# Altium schematic sheet Power Input and Buck Convertors.SchDoc
size A4; SheetNumber: 10; SheetTotal: 10
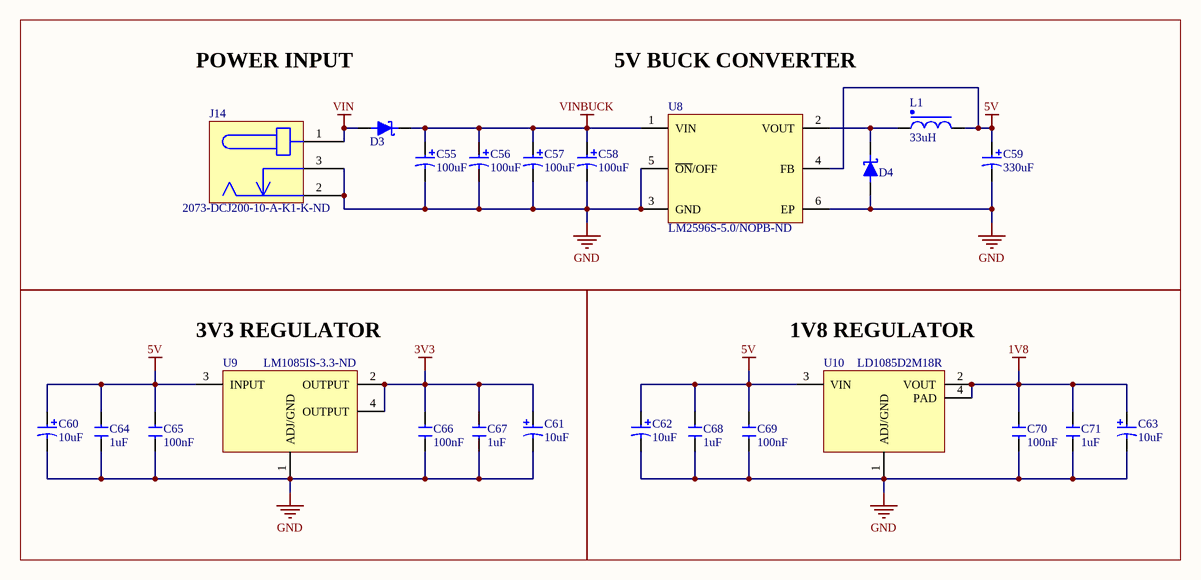
[diagram p0: Power Input and Buck Convertors.SchDoc]

## Parts
C55  Capacitance: 100uF  [RADIAL-2_6.3MMX7.7MM]  (hidden comment: CAP_100uF_%20_25V_ALUM_SMD)
C56  Capacitance: 100uF  [RADIAL-2_6.3MMX7.7MM]  (hidden comment: CAP_100uF_%20_25V_ALUM_SMD)
C57  Capacitance: 100uF  [RADIAL-2_6.3MMX7.7MM]  (hidden comment: CAP_100uF_%20_25V_ALUM_SMD)
C58  Capacitance: 100uF  [RADIAL-2_6.3MMX7.7MM]  (hidden comment: CAP_100uF_%20_25V_ALUM_SMD)
C59  Capacitance: 330uF  [RADIAL-2_8MMX10MM]  (hidden comment: CAP_330uF_%20_25V_ALUM_SMD)
C60  Capacitance: 10uF  [1206_TANT_CAP]  (hidden comment: CAP_10uF_10%_1206_10V_TANT)
C61  Capacitance: 10uF  [1206_TANT_CAP]  (hidden comment: CAP_10uF_10%_1206_10V_TANT)
C62  Capacitance: 10uF  [1206_TANT_CAP]  (hidden comment: CAP_10uF_10%_1206_10V_TANT)
C63  Capacitance: 10uF  [1206_TANT_CAP]  (hidden comment: CAP_10uF_10%_1206_10V_TANT)
C64  1uF  [0805_CAP]
C65  Capacitance: 100nF  [0805_CAP]  (hidden comment: CAP_0.1uF_%20_50V_0805_X7R_CER)
C66  Capacitance: 100nF  [0805_CAP]  (hidden comment: CAP_0.1uF_%20_50V_0805_X7R_CER)
C67  1uF  [0805_CAP]
C68  1uF  [0805_CAP]
C69  Capacitance: 100nF  [0805_CAP]  (hidden comment: CAP_0.1uF_%20_50V_0805_X7R_CER)
C70  Capacitance: 100nF  [0805_CAP]  (hidden comment: CAP_0.1uF_%20_50V_0805_X7R_CER)
C71  1uF  [0805_CAP]
D3  D1FH3/5053  [DIOM5226X220N_D1FH3/5053]  (value not drawn)
D4  DIODE_SCHOTTKY_60V_3A_DO-214AC/SMA  [DIOM5226X220N-SMA]  (value not drawn)
J14  Supplier Part Number 1: 2073-DCJ200-10-A-K1-K-ND  [DC_POWER_JACK_2MM]  (hidden comment: CON_JACK_POWER_PCB TYPE_2MM_KLS)
L1  Inductance: 33uH  [INDP120120X800N]  (hidden comment: IND_33uH_5A_65mOHM_12X12MM_SMD)
U8  Supplier Part Number 1: LM2596S-5.0/NOPB-ND  [TO170P1524X483-6N]  (hidden comment: PMIC_LM2596S-5.0/NOPB)
U9  Supplier Part Number 1: LM1085IS-3.3-ND  [TO254P1524X483-4N]  (hidden comment: PMIC_LIN REG_LM1085IS-3.3)
U10  LD1085D2M18R  [DPAK254P1542X460-4N]

## Blocks framed on the sheet
3V3 REGULATOR: C60 C61 C64-C67 U9
1V8 REGULATOR: C62 C63 C68-C71 U10

## Nets
1V8: C63.1 C70.2 C71.2 U10.2(VOUT) U10.4(PAD)
3V3: C61.1 C66.2 C67.2 U9.2(OUTPUT) U9.4(OUTPUT)
5V: C59.1 C60.1 C62.1 C64.2 C65.2 C68.2 C69.2 L1.2 U8.4(FB) U9.3(INPUT) U10.3(VIN)
GND: C55.2 C56.2 C57.2 C58.2 C59.2 C60.2 C61.2 C62.2 C63.2 C64.1 C65.1 C66.1 C67.1 C68.1 C69.1 C70.1 C71.1 D4.2(ANODE) J14.2(GND) J14.3(GND) U8.3(GND) U8.5(~{ON}/OFF) U8.6(EP) U9.1(ADJ/GND) U10.1(ADJ/GND)
VIN: D3.2(ANODE) J14.1(VIN)
VINBUCK: C55.1 C56.1 C57.1 C58.1 D3.1(CATHODE) U8.1(VIN)
NetD4_1: D4.1(CATHODE) L1.1 U8.2(VOUT)

## Notes on the sheet
- POWER INPUT
- 5V BUCK CONVERTER

## Library data of the parts
C55-C58 = CAP_100uF_%20_25V_ALUM_SMD: CAP.EL.100uF 25V 6.3x7.7 105C 5000HRS SMD; Manufacturer: SAMYOUNG; Manufacturer Part Number: BLA25VC100MF80TP; Ripple Current: 230mA; Tolerance: 20%; Category: Aluminum Electrolytic Capacitors; Voltage Rating: 25V
C59 = CAP_330uF_%20_25V_ALUM_SMD: CAP.EL.330uF 25V 8x10 105C 5000Hrs SMD AECQ-200; Manufacturer: SAMYOUNG; Manufacturer Part Number: BXJ25VC330MH10TP; Ripple Current: 600mA; Tolerance: 20%; Category: Aluminum Electrolytic Capacitors; Voltage Rating: 25V
C60-C63 = CAP_10uF_10%_1206_10V_TANT: Cap Tant Solid 10uF 10V A CASE 10% (3.2 X 1.6 X 1.6mm) Inward L SMD 3216-18 3 Ohm 125C T/R; Manufacturer: Kyocera AVX; Manufacturer Part Number: TAJA106K010SNJ; ESR (Equivalent Series Resistance): 3R; Leakage Current: 1uA; Polarity: Polar; Dissipation Factor: 6%; Supplier 1: Digi-Key; RoHS: Yes; Category: Tantalum Capacitors; Stock 1: 14579; Pricing 1: 1=0,31000, 10=0,21300, 50=0,14920, 100=0,12780, 500=0,09584, 1000=0,08094, 2500=0,07668 (USD); Case/Package: Molded; Number of Pins: 2; Case Code (Imperial): 1206; Case Code (Metric): 3216; Min Operating Temperature: -55°C; Max Operating Temperature: 125°C; Tolerance: 10%; Packaging: Tape and Reel; Voltage Rating: 10V; Package Quantity: 8000; Termination: SMD/SMT; Voltage Rating (DC): 10V; Series: TAJ; Construction: Flat; Length: 3.2mm; Width: 1.6mm; Height: 1.8mm; Depth: 1.6mm; Radiation Hardening: No; Lead Free: Lead Free; RoHS Compliant: Yes; ComponentLink1URL: https://datasheet.ciiva.com/12909/taj-27497-12909898.pdf?src-supplier=Mouser; ComponentLink1Description: https://datasheet.ciiva.com/12909/taj-27497-12909898.pdf?src-supplier=Mouser; Supplier Part Number 1: 478-13122-1-ND
C64 C67 C68 C71 = CAP_1uF_%10_25V_0805_X7R_CER: 陶瓷电容 1uF(105) 1uF ±10% 25V 0805; Manufacturer: Samsung; Manufacturer Part Number: CL21B105KAFNNNG; Material: Ceramic; Dielectric: X7R; Supplier 1: Digi-Key; RoHS: Yes; Category: Ceramic Capacitors; Stock 1: 509034; Pricing 1: 1=0,10000, 10=0,07100, 50=0,03880, 100=0,03170, 500=0,02264, 1000=0,01779 (USD); Mount: Surface Mount; Case/Package: 0805; Case Code (Metric): 2012; Case Code (Imperial): 0805; Min Operating Temperature: -55°C; Max Operating Temperature: 125°C; Tolerance: 10%; Capacitance: 1uF; Voltage Rating: 25V; Package Quantity: 3000; Packaging: Tape and Reel; Voltage: 25V; Series: CL; Length: 2mm; Width: 0.049inch; Height: 1.25mm; Thickness: 0.053inch; Depth: 1.25mm; Radiation Hardening: No; RoHS Compliant: Yes; ComponentLink1URL: https://datasheet.ciiva.com/26920/getdatasheetpartid-698495-26920200.pdf?src-supplier=Verical; ComponentLink1Description: https://datasheet.ciiva.com/26920/getdatasheetpartid-698495-26920200.pdf?src-supplier=Verical; ComponentLink2URL: https://datasheet.ciiva.com/29199/455911-da-01-en-vs-kondensator-0805-29199043.pdf?src-supplier=Conrad; ComponentLink2Description: https://datasheet.ciiva.com/29199/455911-da-01-en-vs-kondensator-0805-29199043.pdf?src-supplier=Conrad; ComponentLink3URL: https://datasheet.ciiva.com/16428/cl05b104kq5nnnc-16428871.pdf?src-supplier=Future+Electronics; ComponentLink3Description: https://datasheet.ciiva.com/16428/cl05b104kq5nnnc-16428871.pdf?src-supplier=Future+Electronics; Supplier Part Number 1: 1276-6469-1-ND
C65 C66 C69 C70 = CAP_0.1uF_%20_50V_0805_X7R_CER: Cap Ceramic 0.1uF 50V X7R 20% SMD 0805 125C Paper T/R; Manufacturer: KEMET; Manufacturer Part Number: C0805C104M5RACTU; Supplier 1: Digi-Key; RoHS: Yes; Category: Ceramic Capacitors; Stock 1: 4863; Pricing 1: 1=0,10000, 10=0,06400, 50=0,03500, 100=0,02860, 500=0,02040, 1000=0,01603 (USD); Mount: Surface Mount; Case/Package: 0805; Dielectric Material: Ceramic; Min Operating Temperature: -55°C; Max Operating Temperature: 125°C; Tolerance: 20%; Dielectric: X7R; Packaging: Tape and Reel; Voltage Rating (DC): 50V; Length: 2mm; Height: 0.9mm; Depth: 1.25mm; Radiation Hardening: No; ComponentLink1URL: http://uk.rs-online.com/webdocs/13da/0900766b813daa06.pdf?src-supplier=RSComponents; ComponentLink1Description: http://uk.rs-online.com/webdocs/13da/0900766b813daa06.pdf?src-supplier=RSComponents; ComponentLink2URL: https://www.verical.com/server-webapp/html/getDatasheet?partID=774625&src-supplier=Verical; ComponentLink2Description: https://www.verical.com/server-webapp/html/getDatasheet?partID=774625&src-supplier=Verical; ComponentLink3URL: http://www.farnell.com/datasheets/2739857.pdf?src-supplier=Farnell; ComponentLink3Description: http://www.farnell.com/datasheets/2739857.pdf?src-supplier=Farnell; ComponentLink4URL: http://uk.rs-online.com/webdocs/1515/0900766b81515223.pdf?src-supplier=RSComponents; ComponentLink4Description: http://uk.rs-online.com/webdocs/1515/0900766b81515223.pdf?src-supplier=RSComponents; ComponentLink5URL: http://components.arrow.com/part/dataview/0323_00324812?src-supplier=Arrow+Europe; ComponentLink5Description: http://components.arrow.com/part/dataview/0323_00324812?src-supplier=Arrow+Europe; ComponentLink6URL: http://uk.rs-online.com/webdocs/1528/0900766b81528e2f.pdf?src-supplier=RSComponents; ComponentLink6Description: http://uk.rs-online.com/webdocs/1528/0900766b81528e2f.pdf?src-supplier=RSComponents; ComponentLink7URL: http://www.farnell.com/datasheets/2739857.pdf?src-supplier=Newark; ComponentLink7Description: http://www.farnell.com/datasheets/2739857.pdf?src-supplier=Newark; ComponentLink8URL: http://www.alliedelec.com/m/d/9bfe7773041ffe9d406e68bc7b377fdd.pdf?src-supplier=Allied+Electronics; ComponentLink8Description: http://www.alliedelec.com/m/d/9bfe7773041ffe9d406e68bc7b377fdd.pdf?src-supplier=Allied+Electronics; ComponentLink9URL: https://api.kemet.com/component-edge/download/datasheet/C0805C104M5RACTU.pdf?src-supplier=Digi-Key; ComponentLink9Description: https://api.kemet.com/component-edge/download/datasheet/C0805C104M5RACTU.pdf?src-supplier=Digi-Key; ComponentLink10URL: http://capacitoredge.kemet.com/capedge2/DataSheet?pn=C0805C104M5RACTU&src-supplier=Avnet+Europe; ComponentLink10Description: http://capacitoredge.kemet.com/capedge2/DataSheet?pn=C0805C104M5RACTU&src-supplier=Avnet+Europe; ComponentLink11URL: http://www.farnell.com/datasheets/2739857.pdf?src-supplier=Element14; ComponentLink11Description: http://www.farnell.com/datasheets/2739857.pdf?src-supplier=Element14; ComponentLink12URL: http://www.mouser.com/ds/2/212/KEM_C1002_X7R_SMD-1102033.pdf?src-supplier=Mouser; ComponentLink12Description: http://www.mouser.com/ds/2/212/KEM_C1002_X7R_SMD-1102033.pdf?src-supplier=Mouser; ComponentLink13URL: https://www.verical.com/server-webapp/html/getDatasheet?partID=91523&src-supplier=Verical; ComponentLink13Description: https://www.verical.com/server-webapp/html/getDatasheet?partID=91523&src-supplier=Verical; ComponentLink14URL: http://components.arrow.com/part/dataview/2091108S8109171N7429?src-supplier=Arrow+Electronics; ComponentLink14Description: http://components.arrow.com/part/dataview/2091108S8109171N7429?src-supplier=Arrow+Electronics; Supplier Part Number 1: 399-C0805C104M5RAC7800CT-ND
D3 = DIODE_SCHOTTKY_30V_3A_DO214AC/SMA_SMT: Schottky-diode 3A 30V 1F; Manufacturer: Shindengen; Supplier 1: Mouser; RoHS: Yes; Category: Uncategorized; ComponentLink1URL: https://datasheet.ciiva.com/13080/j532-d1fh3-30122-13080653.pdf?src-supplier=Mouser; ComponentLink1Description: https://datasheet.ciiva.com/13080/j532-d1fh3-30122-13080653.pdf?src-supplier=Mouser; Packaging: Tape and Reel; Manufacturer Part Number: D1FH3/5053; Supplier Part Number 1: 627-D1FH35053; Case/Package: SMA
D4 = DIODE_SCHOTTKY_60V_3A_DO-214AC/SMA: DIODE SCHOTTKY 3A 60V DO-214AC SMA; Manufacturer Part Number: SS36-JQ; Average Rectified Current: 3A; Max Repetitive Reverse Voltage (Vrrm): 60V; Case/Package: SMA
J14 = CON_JACK_POWER_PCB TYPE_2MM_KLS: DCJ200 Series 20 V 5 A Horizontal PCB Mount Jack Power Jack; Manufacturer: Global Connector Technology; Manufacturer Part Number: DCJ200-10-A-K1-K; Voltage Rating (DC): 20V; Gender: Male; Current Rating: 5A; Supplier 1: Digi-Key; RoHS: Yes; Termination: Through Hole; Voltage Rating: 20V; ComponentLink1URL: http://www.farnell.com/datasheets/2342921.pdf?src-supplier=Farnell; ComponentLink1Description: http://www.farnell.com/datasheets/2342921.pdf?src-supplier=Farnell
L1 = IND_33uH_5A_65mOHM_12X12MM_SMD: INDUCTOR POWER 33UH 12X12MM SMD; Manufacturer: CORE MASTER; Manufacturer Part Number: SRI1207-330M; Current Rating: 5A; Tolerance: 20%; DC Resistance (DCR): 65mR
U8 = PMIC_LM2596S-5.0/NOPB: SIMPLE SWITCHER® 4.5V to 40V, 3A Low Component Count Step-Down Regulator 5-DDPAK/TO-263; Manufacturer: TI National Semiconductor; Efficiency: 80%; Number of Outputs: 1; Output Voltage: 5V; Switching Frequency: 173kHz; Quiescent Current: 5mA; Output Type: Fixed; Supplier 1: Digi-Key; Manufacturer Part Number: LM2596S-5.0/NOPB; RoHS: Yes; Category: Power Supply Modules; Pricing 1: 1=7,14000, 10=6,45200, 25=6,15160, 100=5,34150, 250=5,10148, 500=4,95424 (USD); Mount: Surface Mount; Case/Package: TO-263; Number of Pins: 5; Weight: 0.25lb; Contact Plating: Tin,Matte; Min Operating Temperature: -40°C; Max Operating Temperature: 125°C; Min Input Voltage: 4.5V; Output Current: 3A; Packaging: Rail/Tube; Max Output Current: 3A; Max Input Voltage: 40V; Package Quantity: 45; Operating Supply Voltage: 40V; Series: LM2596; Nominal Output Voltage: 5V; Length: 10.16mm; Width: 8.64mm; Height: 4.57mm; Radiation Hardening: No; Lead Free: Contains Lead; REACH SVHC: No SVHC; RoHS Compliant: Yes; ComponentLink1URL: https://datasheet.ciiva.com/14150/jqlm2596x-xx-e-14150651.pdf?src-supplier=Distrelec; ComponentLink1Description: https://datasheet.ciiva.com/14150/jqlm2596x-xx-e-14150651.pdf?src-supplier=Distrelec; ComponentLink2URL: https://datasheet.ciiva.com/27050/836385-27050287.pdf?src-supplier=Jameco; ComponentLink2Description: https://datasheet.ciiva.com/27050/836385-27050287.pdf?src-supplier=Jameco; ComponentLink3URL: https://datasheet.ciiva.com/15112/getdatasheetpartid-112894-15112928.pdf?src-supplier=Verical; ComponentLink3Description: https://datasheet.ciiva.com/15112/getdatasheetpartid-112894-15112928.pdf?src-supplier=Verical; ComponentLink4URL: https://datasheet.ciiva.com/41457/001013813-da-01-en-ic-reg-buc-lm2596s-5-0-nopb-to-263-5-tid-41457757.pdf?src-supplier=Conrad; ComponentLink4Description: https://datasheet.ciiva.com/41457/001013813-da-01-en-ic-reg-buc-lm2596s-5-0-nopb-to-263-5-tid-41457757.pdf?src-supplier=Conrad; ComponentLink5URL: https://datasheet.ciiva.com/22669/1874590-22669463.pdf?src-supplier=Element14; ComponentLink5Description: https://datasheet.ciiva.com/22669/1874590-22669463.pdf?src-supplier=Element14; ComponentLink6URL: https://datasheet.ciiva.com/6596/lm2596-6596343.pdf?src-supplier=Digi-Key; ComponentLink6Description: https://datasheet.ciiva.com/6596/lm2596-6596343.pdf?src-supplier=Digi-Key
U9 = PMIC_LIN REG_LM1085IS-3.3: 3-A, 29-V, linear voltage regulator 3-DDPAK/TO-263 -40 to 125; Manufacturer: TI National Semiconductor; Output Voltage: 3.3V; Number of Outputs: 1; Min Input Voltage: 2.6V; Max Input Voltage: 27V; Max Output Current: 3A; Dropout Voltage: 1.3V; Polarity: Positive; Quiescent Current: 10mA; Output Type: Fixed; Min Current Limit: 3.2A; Supplier 1: Digi-Key; Manufacturer Part Number: LM1085IS-3.3; RoHS: No; Category: Voltage Regulators - Linear; Stock 1: 971; Pricing 1: 1=3,60000, 10=3,23200, 25=3,05520, 100=2,64780, 250=2,51204, 500=2,25404, 1000=2,24175 (USD); Mount: Surface Mount; Case/Package: TO-263; Number of Pins: 3; Min Operating Temperature: -40°C; Max Operating Temperature: 125°C; Packaging: Rail/Tube; Package Quantity: 45; Output Current: 3A; Current Rating: 3A; Number of Regulators: 1; Series: -; Radiation Hardening: No; Lead Free: Contains Lead; RoHS Compliant: No; ComponentLink1URL: https://datasheet.ciiva.com/6582/lm1085-6582479.pdf?src-supplier=Digi-Key; ComponentLink1Description: https://datasheet.ciiva.com/6582/lm1085-6582479.pdf?src-supplier=Digi-Key
U10 = PMIC_LDO_LD1085D2M18R: LDO Regulator Pos 1.8V 3A Automotive 4-Pin(3+Tab) D2PAK/A T/R; Manufacturer: STMicroelectronics; Number of Outputs: 1; Max Input Voltage: 30V; Polarity: Positive; Quiescent Current: 10mA; Accuracy: 1%; Output Type: Fixed; Dropout Voltage: 1.3V; Input Bias Current: 5mA; Supplier 1: Digi-Key; Manufacturer Part Number: LD1085D2M18R; RoHS: Yes; Category: Voltage Regulators - Linear; Stock 1: 10832; Pricing 1: 1=2,08000, 10=1,86900, 25=1,76360, 100=1,50260, 250=1,41088, 500=1,23450 (USD); Mount: Surface Mount; Case/Package: D2PAK; Number of Pins: 4; Min Operating Temperature: -40°C; Max Operating Temperature: 125°C; Max Output Current: 3A; Output Voltage: 1.8V; Packaging: Tape and Reel; Package Quantity: 1000; Output Current: 3A; Number of Regulators: 1; Output Voltage Accuracy: 1%; Series: -; Length: 10.4mm; Width: 9.35mm; Height: 4.6mm; Radiation Hardening: No; RoHS Compliant: Yes; ComponentLink1URL: https://datasheet.ciiva.com/2050/cd00001883-2050688.pdf?src-supplier=Digi-Key; ComponentLink1Description: https://datasheet.ciiva.com/2050/cd00001883-2050688.pdf?src-supplier=Digi-Key; ComponentLink2URL: https://datasheet.ciiva.com/2050/cd00001883-2050689.pdf?src-supplier=Digi-Key; ComponentLink2Description: https://datasheet.ciiva.com/2050/cd00001883-2050689.pdf?src-supplier=Digi-Key; ComponentLink3URL: https://datasheet.ciiva.com/2050/cd00001883-2050690.pdf?src-supplier=Digi-Key; ComponentLink3Description: https://datasheet.ciiva.com/2050/cd00001883-2050690.pdf?src-supplier=Digi-Key; ComponentLink4URL: https://datasheet.ciiva.com/2050/cd00001883-2050691.pdf?src-supplier=Digi-Key; ComponentLink4Description: https://datasheet.ciiva.com/2050/cd00001883-2050691.pdf?src-supplier=Digi-Key; Supplier Part Number 1: 497-LD1085D2M18RDKR-ND